# Altium project 2014_IHM.PrjPcb
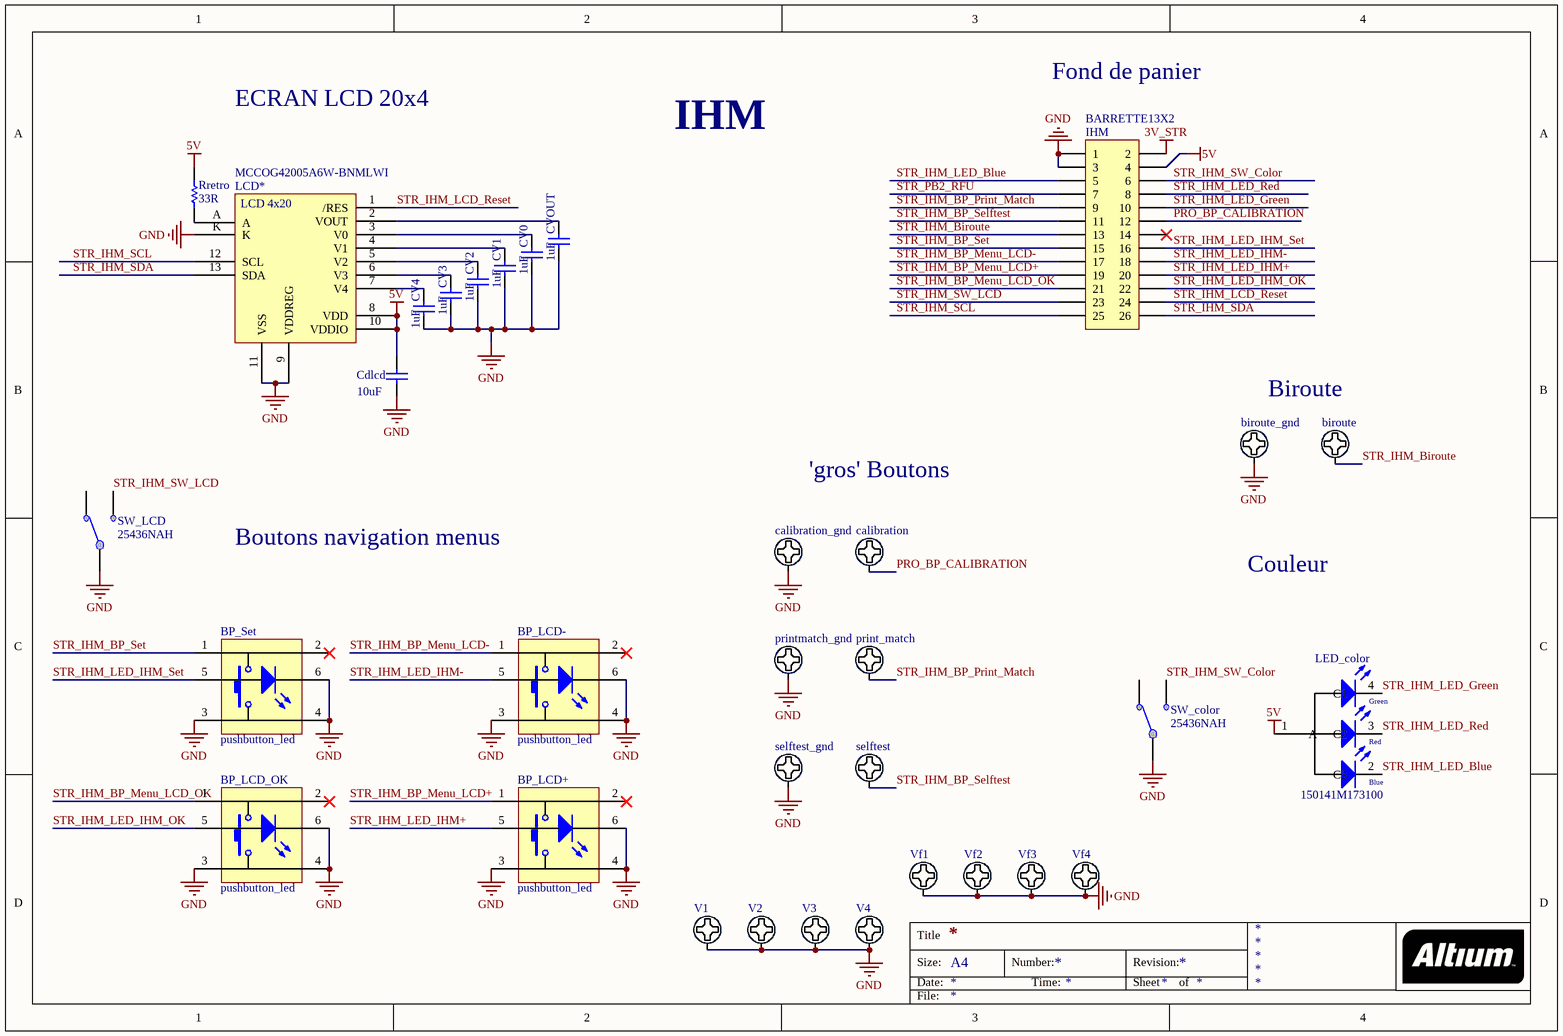
[diagram p0: 2014_IHM.SchDoc]
1 sheet, 33 parts. Net scope: global (net labels, ports and power ports of the same name join across sheets).
Board file: 2014_IHM.PcbDoc

## Sheet 2014_IHM.SchDoc
size A4

### Parts
biroute  Pad_M3  [PAD_CMS_5.08x2.54]  (value not drawn)
biroute_gnd  Pad_M3  [PAD_CMS_5.08x2.54]  (value not drawn)
BP_LCD+  pushbutton_led  [PUSHBUTTON_LED_FlecheDroite]
BP_LCD-  pushbutton_led  [PUSHBUTTON_LED_FlecheGauche]
BP_LCD_OK  pushbutton_led  [PUSHBUTTON_LED_OK]
BP_Set  pushbutton_led  [PUSHBUTTON_LED_SET]
calibration  Pad_M3  [PAD_CMS_5.08x2.54]  (value not drawn)
calibration_gnd  Pad_M3  [PAD_CMS_5.08x2.54]  (value not drawn)
Cdlcd  10uF  [C0805_N]
CV0  1uF  [C0805_N]
CV1  1uF  [C0805_N]
CV2  1uF  [C0805_N]
CV3  1uF  [C0805_N]
CV4  1uF  [C0805_N]
CVOUT  1uF  [C0805_N]
IHM  BARRETTE13X2  [HE10/26_M_D_BP]
LCD*  MCCOG42005A6W-BNMLWI  [LCD_4X20_MIDAS]
LED_color  150141M173100  [3528]
print_match  Pad_M3  [PAD_CMS_5.08x2.54]  (value not drawn)
printmatch_gnd  Pad_M3  [PAD_CMS_5.08x2.54]  (value not drawn)
Rretro  33R  [R1206_N]
selftest  Pad_M3  [PAD_CMS_5.08x2.54]  (value not drawn)
selftest_gnd  Pad_M3  [PAD_CMS_5.08x2.54]  (value not drawn)
SW_color  25436NAH  [SW_UNIPOL_DROIT - APEM 523X B]
SW_LCD  25436NAH  [SW_UNIPOL_DROIT - APEM 523X B]
V1  Pad_M3  [M3x6mm]  (value not drawn)
V2  Pad_M3  [M3x6mm]  (value not drawn)
V3  Pad_M3  [M3x6mm]  (value not drawn)
V4  Pad_M3  [M3x6mm]  (value not drawn)
Vf1  Pad_M3  [M3x6mm]  (value not drawn)
Vf2  Pad_M3  [M3x6mm]  (value not drawn)
Vf3  Pad_M3  [M3x6mm]  (value not drawn)
Vf4  Pad_M3  [M3x6mm]  (value not drawn)

### Nets
3V_STR: IHM.2
5V: Cdlcd.1 IHM.4 LCD*.8(VDD) LCD*.10(VDDIO) LED_color.1(A) Rretro.2
GND: biroute_gnd.1 BP_LCD+.3 BP_LCD+.4 BP_LCD+.6(-) BP_LCD-.3 BP_LCD-.4 BP_LCD-.6(-) BP_LCD_OK.3 BP_LCD_OK.4 BP_LCD_OK.6(-) BP_Set.3 BP_Set.4 BP_Set.6(-) calibration_gnd.1 Cdlcd.2 CV0.2 CV1.2 CV2.2 CV3.2 CV4.2 CVOUT.2 IHM.1 IHM.3 LCD*.9(VDDREG) LCD*.11(VSS) LCD*.K printmatch_gnd.1 selftest_gnd.1 SW_color.COMMON1 SW_LCD.COMMON1 V1.1 V2.1 V3.1 V4.1 Vf1.1 Vf2.1 Vf3.1 Vf4.1
PRO_BP_CALIBRATION: calibration.1 IHM.12
STR_IHM_Biroute: biroute.1 IHM.13
STR_IHM_BP_Menu_LCD+: BP_LCD+.1 IHM.19
STR_IHM_BP_Menu_LCD-: BP_LCD-.1 IHM.17
STR_IHM_BP_Menu_LCD_OK: BP_LCD_OK.1 IHM.21
STR_IHM_BP_Print_Match: IHM.9 print_match.1
STR_IHM_BP_Selftest: IHM.11 selftest.1
STR_IHM_BP_Set: BP_Set.1 IHM.15
STR_IHM_LCD_Reset: IHM.24 LCD*.1(/RES)
STR_IHM_LED_Blue: IHM.5 LED_color.2(C3)
STR_IHM_LED_Green: IHM.10 LED_color.4(C1)
STR_IHM_LED_IHM+: BP_LCD+.5(+) IHM.20
STR_IHM_LED_IHM-: BP_LCD-.5(+) IHM.18
STR_IHM_LED_IHM_OK: BP_LCD_OK.5(+) IHM.22
STR_IHM_LED_IHM_Set: BP_Set.5(+) IHM.16
STR_IHM_LED_Red: IHM.8 LED_color.3(C2)
STR_IHM_SCL: IHM.25 LCD*.12(SCL)
STR_IHM_SDA: IHM.26 LCD*.13(SDA)
STR_IHM_SW_Color: IHM.6 SW_color.NO1
STR_IHM_SW_LCD: IHM.23 SW_LCD.NO1
STR_PB2_RFU: IHM.7
NetCV0_1: CV0.1 LCD*.3(V0)
NetCV1_1: CV1.1 LCD*.4(V1)
NetCV2_1: CV2.1 LCD*.5(V2)
NetCV3_1: CV3.1 LCD*.6(V3)
NetCV4_1: CV4.1 LCD*.7(V4)
NetCVOUT_1: CVOUT.1 LCD*.2(VOUT)
NetLCD*_A: LCD*.A Rretro.1

Not connected (* = marked no-connect by the designer): BP_LCD+ 2(3)*; BP_LCD- 2(3)*; BP_LCD_OK 2(3)*; BP_Set 2(3)*; IHM 14*; SW_color NC1; SW_LCD NC1

### Notes on the sheet
- ECRAN LCD 20x4
- Fond de panier
- IHM
- Biroute
- 'gros' Boutons
- Boutons navigation menus
- Couleur
- Title
- Size:
- Date:
- A4
- Number:
- Time:
- Revision:
- Sheet
- of
- File:
- (in symbol LCD_MIDAS_4x20) LCD 4x20
- (in symbol WL-SFTW 3528 150141M173100) Green; Red; Blue

### Library data of the parts
biroute biroute_gnd calibration calibration_gnd print_match printmatch_gnd selftest selftest_gnd V1-V4 Vf1-Vf4 = Vis M3 X 6mm _TORX_Tête 6mm: Publisher: Damien Guitton
Cdlcd CV0-CV4 CVOUT = Condensateur: Capacitor; Published: 8-Jun-2000; LatestRevisionDate: 17-Jul-2002; LatestRevisionNote: Re-released for DXP Platform.; PackageReference: RAD-0.3; Publisher: Altium Limited
IHM = BARRETTE13X2: Header, 13-Pin, Dual row; LatestRevisionDate: 17-Jul-2002; LatestRevisionNote: Re-released for DXP Platform.; Publisher: Altium Limited
LCD* = LCD_MIDAS_4x20: FAR: 2218946
LED_color = WL-SFTW 3528 150141M173100: SMD Full-Color Top LED, WL-SFTW, Red & Green & Blue; Manufacturer: Würth Elektronik eiSos GmbH; PartNo: 150141M173100; ComponentLink1Description: Manufacturer; ComponentLink1URL: http://www.we-online.de; Created by: Christin Otto; Created Date: June 2013; ComponentLink2Description: Datasheet; ComponentLink2URL: http://katalog.we-online.com/led/datasheet/150141M173100.pdf; Color: Red & Green & Blue
Rretro = Resistor: Published: 8-Jun-2000; LatestRevisionDate: 17-Jul-2002; LatestRevisionNote: Re-released for DXP Platform.; PackageReference: AXIAL-0.5; Publisher: Altium Limited
SW_color SW_LCD = SW SPDT- APEM Série 523x: Switch unipolaire a levier